# EAGLE schematic VDF_2025 (EAGLE 6.1)
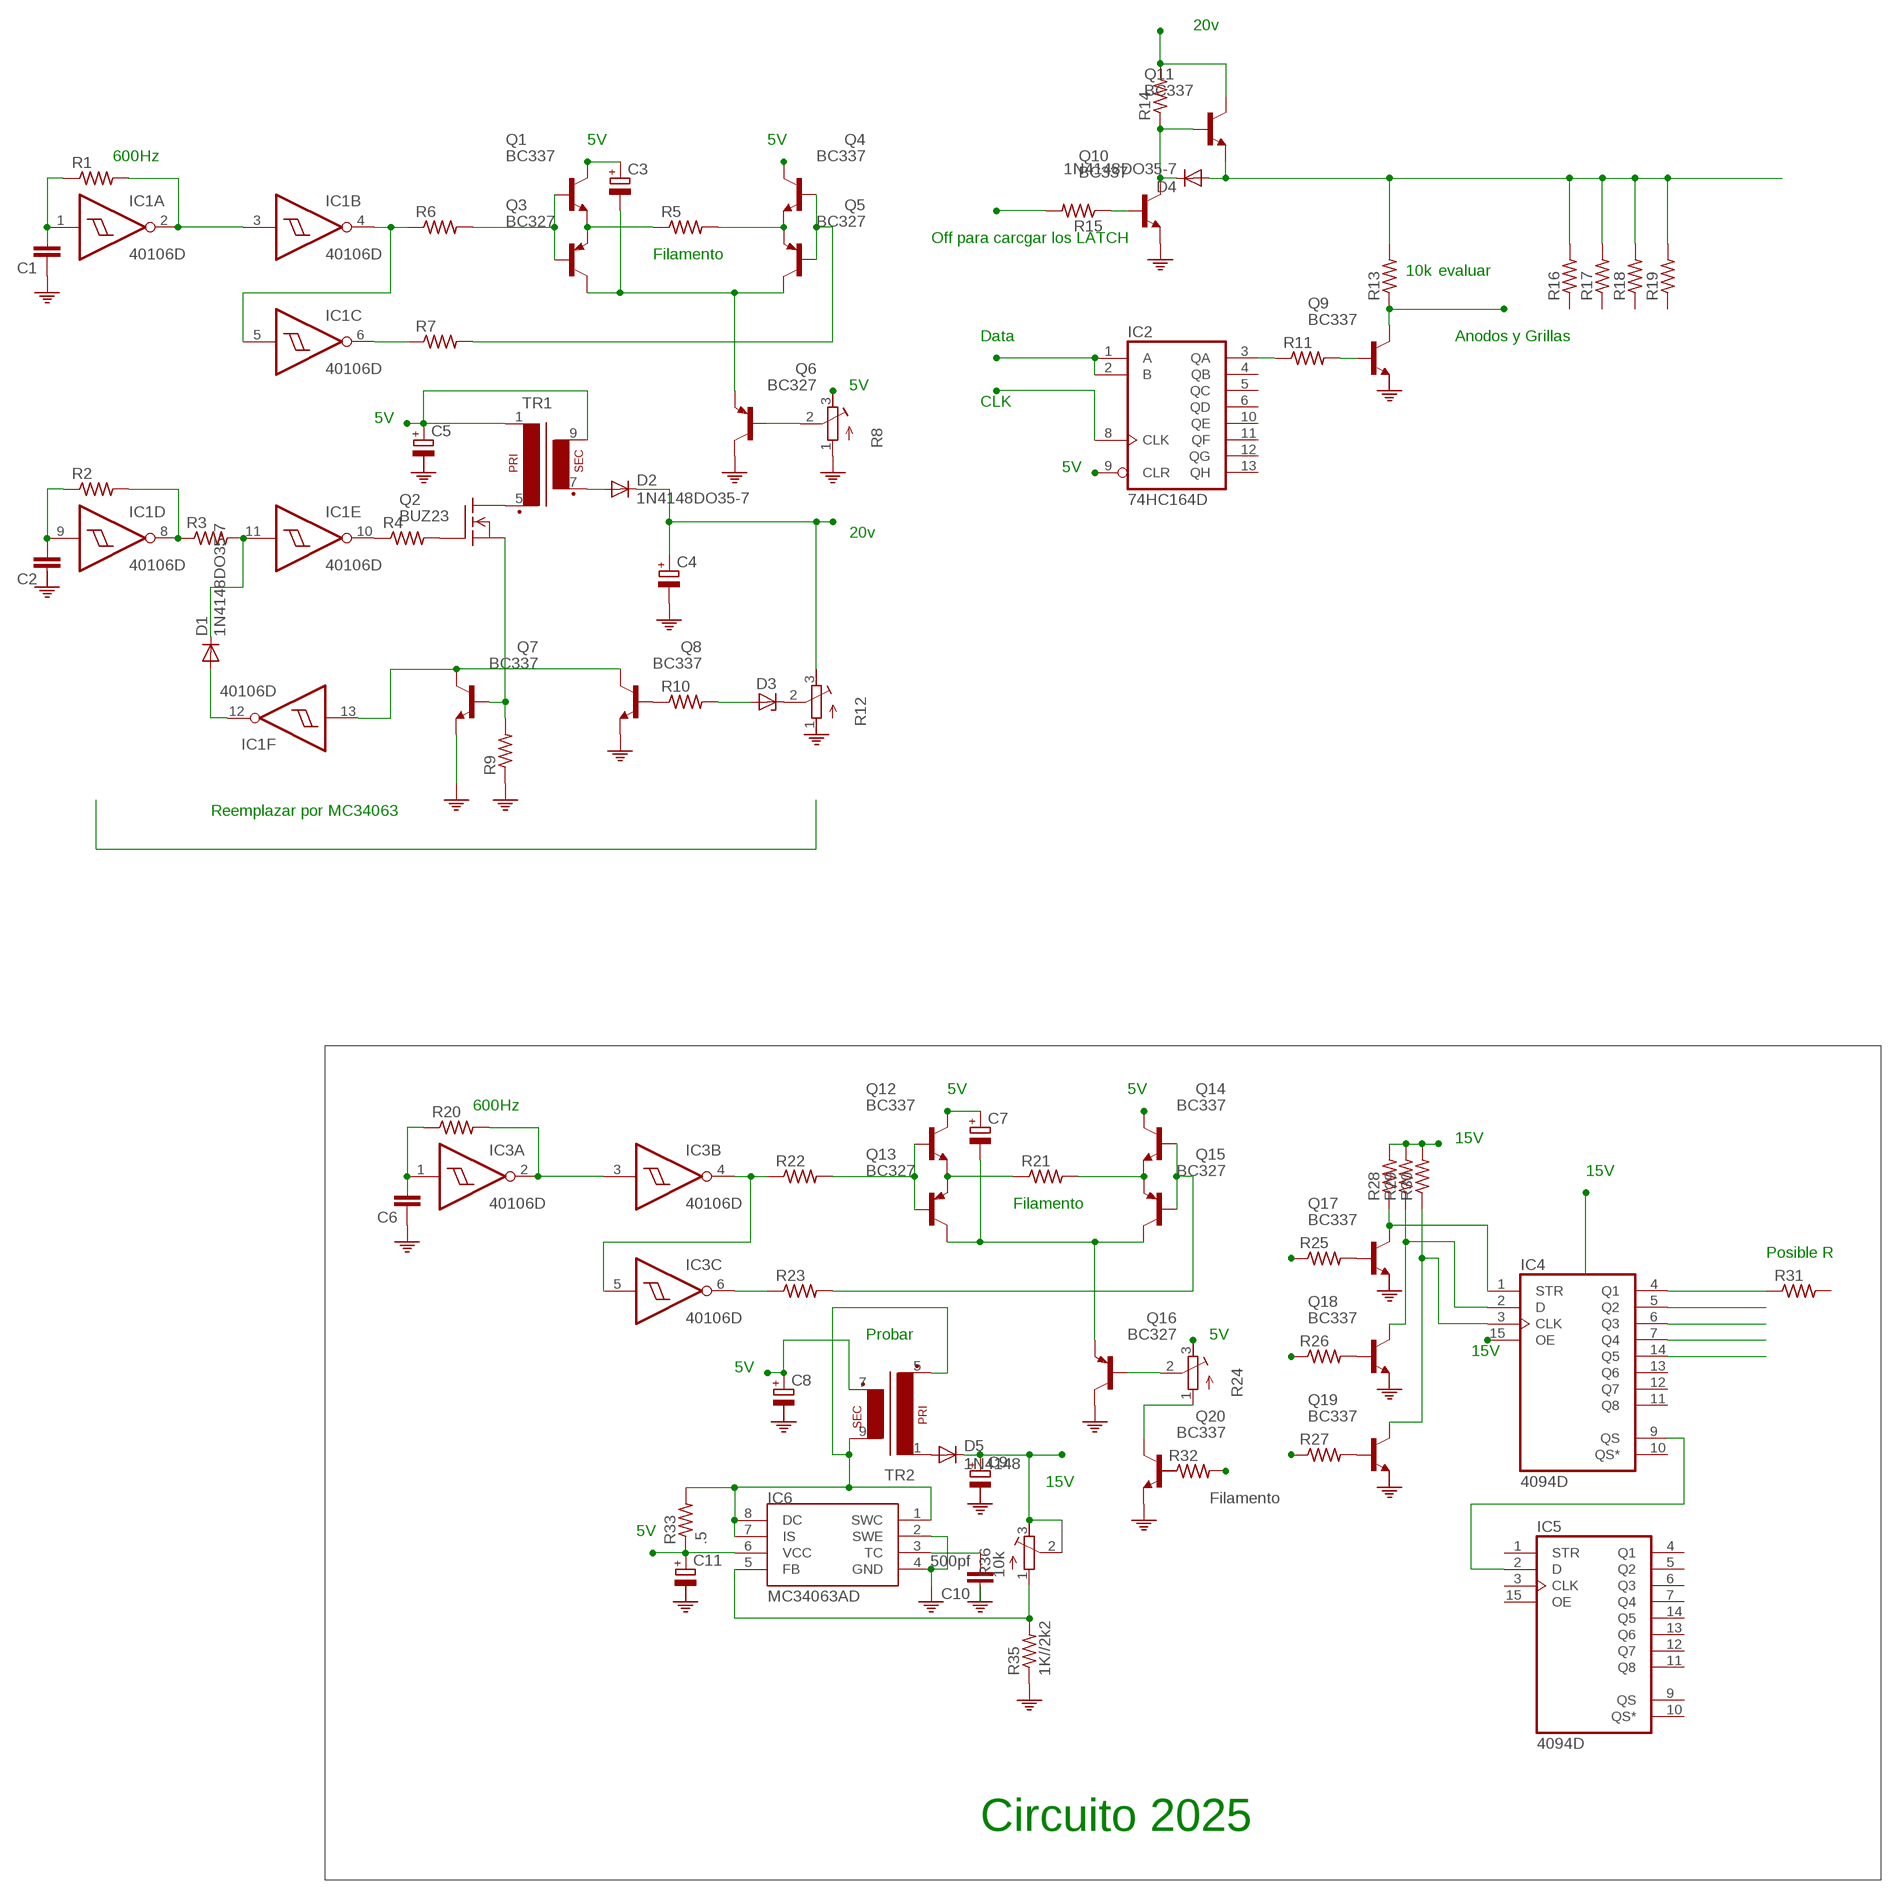
[diagram p0: schematic, sheet 1]

## Parts
C1  C-EU025-060X050  [C025-060X050]
C2  C-EU025-060X050  [C025-060X050]
C3  CPOL-EU139CLL-2R  [139CLL-2R]
C4  CPOL-EU139CLL-2R  [139CLL-2R]
C5  CPOL-EU139CLL-2R  [139CLL-2R]
C6  C-EU025-060X050  [C025-060X050]
C7  CPOL-EU139CLL-2R  [139CLL-2R]
C8  CPOL-EU139CLL-2R  [139CLL-2R]
C9  CPOL-EU139CLL-2R  [139CLL-2R]
C10  500pf  C-EU025-060X050  [C025-060X050]
C11  CPOL-EU139CLL-2R  [139CLL-2R]
D1  1N4148DO35-7  [DO35-7]
D2  1N4148DO35-7  [DO35-7]
D3  ZENER-DIODEDO13M  [DO13M]
D4  1N4148DO35-7  [DO35-7]
D5  1N4148  1N4148DO35-7  [DO35-7]
IC1  40106D  [SO14]
IC2  74HC164D  [SO14]
IC3  40106D  [SO14]
IC4  4094D  [SO16]
IC5  4094D  [SO16]
IC6  MC34063AD  [SOIC8]
Q1  BC337  [TO92]
Q2  BUZ23  [TO3]
Q3  BC327  2N3576  [TO18]
Q4  BC337  [TO92]
Q5  BC327  2N3576  [TO18]
Q6  BC327  2N3576  [TO18]
Q7  BC337  [TO92]
Q8  BC337  [TO92]
Q9  BC337  [TO92]
Q10  BC337  [TO92]
Q11  BC337  [TO92]
Q12  BC337  [TO92]
Q13  BC327  2N3576  [TO18]
Q14  BC337  [TO92]
Q15  BC327  2N3576  [TO18]
Q16  BC327  2N3576  [TO18]
Q17  BC337  [TO92]
Q18  BC337  [TO92]
Q19  BC337  [TO92]
Q20  BC337  [TO92]
R1  R-US_0414/5V  [0414V]
R2  R-US_0414/5V  [0414V]
R3  R-US_0414/5V  [0414V]
R4  R-US_0414/5V  [0414V]
R5  R-US_0414/5V  [0414V]
R6  R-US_0414/5V  [0414V]
R7  R-US_0414/5V  [0414V]
R8  R-TRIMM3103  [RTRIM3103]
R9  R-US_0414/5V  [0414V]
R10  R-US_0414/5V  [0414V]
R11  R-US_0414/5V  [0414V]
R12  R-TRIMM3103  [RTRIM3103]
R13  R-US_0414/5V  [0414V]
R14  R-US_0414/5V  [0414V]
R15  R-US_0414/5V  [0414V]
R16  R-US_0414/5V  [0414V]
R17  R-US_0414/5V  [0414V]
R18  R-US_0414/5V  [0414V]
R19  R-US_0414/5V  [0414V]
R20  R-US_0414/5V  [0414V]
R21  R-US_0414/5V  [0414V]
R22  R-US_0414/5V  [0414V]
R23  R-US_0414/5V  [0414V]
R24  R-TRIMM3103  [RTRIM3103]
R25  R-US_0414/5V  [0414V]
R26  R-US_0414/5V  [0414V]
R27  R-US_0414/5V  [0414V]
R28  R-US_0414/5V  [0414V]
R29  R-US_0414/5V  [0414V]
R30  R-US_0414/5V  [0414V]
R31  R-US_0414/5V  [0414V]
R32  R-US_0414/5V  [0414V]
R33  .5  R-US_0414/5V  [0414V]
R35  1K//2k2  R-US_0414/5V  [0414V]
R36  10k  R-TRIMM3103  [RTRIM3103]
TR1  EI42-1  [EI42-1]
TR2  EI42-1  [EI42-1]

## Nets
N$1: IC1.8(D:O) R2.2 R3.1
N$2: D1.C IC1.11(E:I) R3.2
N$3: IC1.10(E:O) R4.1
N$4: C5.+ TR1.1 TR1.9(S4)
N$5: C2.2 IC1.9(D:I) R2.1
N$6: Q2.2(G) R4.2
N$7: C3.- Q3.3(C) Q5.3(C) Q6.1(E)
N$8: Q1.2(B) Q3.2(B) R6.2
N$9: C3.+ Q1.3(C)
N$10: Q4.3(C)
N$11: Q4.1(E) Q5.1(E) R5.2
N$12: Q1.1(E) Q3.1(E) R5.1
N$13: Q4.2(B) Q5.2(B) R7.2
N$14: IC1.4(B:O) IC1.5(C:I) R6.1
N$15: D2.A TR1.7(S3)
N$16: IC1.6(C:O) R7.1
N$17: C4.+ D2.C R12.3(E)
N$18: IC1.2(A:O) IC1.3(B:I) R1.2
N$19: C1.2 IC1.1(A:I) R1.1
N$20: Q6.2(B) R8.2(S)
N$21: R8.3(E)
N$22: IC1.13(F:I) Q7.3(C) Q8.3(C)
N$23: D1.A IC1.12(F:O)
N$24: Q8.2(B) R10.1
N$25: Q2.1(S) Q7.2(B) R9.2
N$26: D3.A R10.2
N$27: Q2.3(D) Q2.4(D) TR1.5(P2)
N$28: D3.C R12.2(S)
N$30: IC2.1(A) IC2.2(B)
N$31: IC2.8(CLK)
N$32: IC2.9(CLR)
N$33: IC2.3(QA) R11.1
N$34: Q9.2(B) R11.2
N$35: Q9.3(C) R13.1
N$36: C7.+ Q12.3(C)
N$37: Q11.3(C) R14.2
N$38: D4.C Q10.3(C) Q11.2(B) R14.1
N$39: D4.A Q11.1(E) R13.2 R16.2 R17.2 R18.2 R19.2
N$40: Q10.2(B) R15.1
N$41: R15.2
N$42: Q14.3(C)
N$43: Q14.1(E) Q15.1(E) R21.2
N$44: Q12.1(E) Q13.1(E) R21.1
N$45: C7.- Q13.3(C) Q15.3(C) Q16.1(E)
N$46: Q12.2(B) Q13.2(B) R22.2
N$47: Q14.2(B) Q15.2(B) R23.2
N$48: IC3.4(B:O) IC3.5(C:I) R22.1
N$49: IC3.6(C:O) R23.1
N$50: IC3.2(A:O) IC3.3(B:I) R20.2
N$51: C6.2 IC3.1(A:I) R20.1
N$52: Q16.2(B) R24.2(S)
N$53: R24.3(E)
N$54: C8.+ TR2.7(S3)
N$56: Q17.2(B) R25.2
N$57: Q18.2(B) R26.2
N$58: Q19.2(B) R27.2
N$59: IC4.1(STR) Q17.3(C) R28.1
N$60: IC4.2(D) Q18.3(C) R29.1
N$61: IC4.3(CLK) Q19.3(C) R30.1
N$62: R28.2 R29.2 R30.2
N$63: R25.1
N$64: R26.1
N$65: R27.1
N$66: IC4.4(Q1) R31.1
N$67: IC4.5(Q2)
N$68: IC4.6(Q3)
N$69: IC4.15(OE)
N$70: IC4.9(QS) IC5.2(D)
N$71: IC4.7(Q4)
N$72: IC4.14(Q5)
N$73: Q20.3(C) R24.1(A)
N$74: IC6.1(SWC) IC6.7(IS) IC6.8(DC) R33.2 TR2.5(P2) TR2.9(S4)
N$75: R32.2
N$76: C11.+ IC6.6(VCC) R33.1
N$77: D5.A TR2.1
N$78: C9.+ D5.C R36.3(E)
N$80: C10.2 IC6.3(TC)
N$81: IC6.5(FB) R35.2 R36.1(A)
PE: C1.1 C4.- C6.1 C10.1 IC6.2(SWE) IC6.4(GND) Q6.3(C) Q8.1(E) Q10.1(E) Q16.3(C) Q18.1(E) Q20.1(E) R8.1(A) R9.1 R35.1
Unconnected: C2.1 C5.- C8.- C9.- C11.- IC2.4(QB) IC2.5(QC) IC2.6(QD) IC2.10(QE) IC2.11(QF) IC2.12(QG) IC2.13(QH) IC3.8(D:O) IC3.9(D:I) IC3.10(E:O) IC3.11(E:I) IC3.12(F:O) IC3.13(F:I) IC4.10(QS*) IC4.11(Q8) IC4.12(Q7) IC4.13(Q6) IC5.1(STR) IC5.3(CLK) IC5.4(Q1) IC5.5(Q2) IC5.6(Q3) IC5.7(Q4) IC5.9(QS) IC5.10(QS*) IC5.11(Q8) IC5.12(Q7) IC5.13(Q6) IC5.14(Q5) IC5.15(OE) Q7.1(E) Q9.1(E) Q17.1(E) Q19.1(E) Q20.2(B) R12.1(A) R16.1 R17.1 R18.1 R19.1 R31.2 R32.1 R36.2(S)

## Notes on the sheet
- 20v
- 5V | 5V
- 600Hz
- Off para carcgar los LATCH
- Filamento
- 10k | evaluar
- Data | Anodos y Grillas
- 5V
- CLK
- 5V
- 5V
- 20v
- Reemplazar por MC34063
- 5V | 5V
- 600Hz
- 15V
- 15V
- Filamento
- Posible R
- Probar | 5V
- 15V
- 5V
- 15V
- Filamento
- 5V
- Circuito 2025

## Power pins joined to a net without a drawn wire
GND: IC2.7(GND)
VCC: IC2.14(VCC)
VDD: IC1.14(P:VDD) IC3.14(P:VDD) IC4.16(VDD) IC5.16(VDD)
VSS: IC1.7(P:VSS) IC3.7(P:VSS) IC4.8(VSS) IC5.8(VSS)

## Library data of the parts
C1 C2 C6 C10 = rcl:C-EU: CAPACITOR, European symbol
C3-C5 C7-C9 C11 = rcl:CPOL-EU: POLARIZED CAPACITOR, European symbol
D1 D2 D4 D5 = diode:1N4148: DIODE high speed (Philips)
D3 = diode:ZENER-DIODE: Z-Diode
IC1 IC3 = 40xx:40106: Hex SCHMITT TRIGGER
IC2 = 74xx-us:74*164: 8-bit parallel out SHIFT REGISTER
IC4 IC5 = 40xx:4094: 8-stage SHIFT/STORE REGISTER, tri-state
IC6 = mc34063:MC34063
Q1 Q4 Q7-Q12 Q14 Q17-Q20 = transistor-npn:BC337*: NPN Transistor
Q2 = transistor-fet:BUZ23: N-Channel Enhancement MOSFET 100V; 10A; 0,2Ohm
Q3 Q5 Q6 Q13 Q15 Q16 = transistor-pnp:2N3576: PNP Transistor
R1-R7 R9-R11 R13-R23 R25-R33 R35 = rcl:R-US_: RESISTOR, American symbol
R8 R12 R24 R36 = rcl:R-TRIMM: Trimm resistor
TR1 TR2 = trafo:EI42-1: TRANSFORMER 1 primary winding, 1 secondary winding ERA